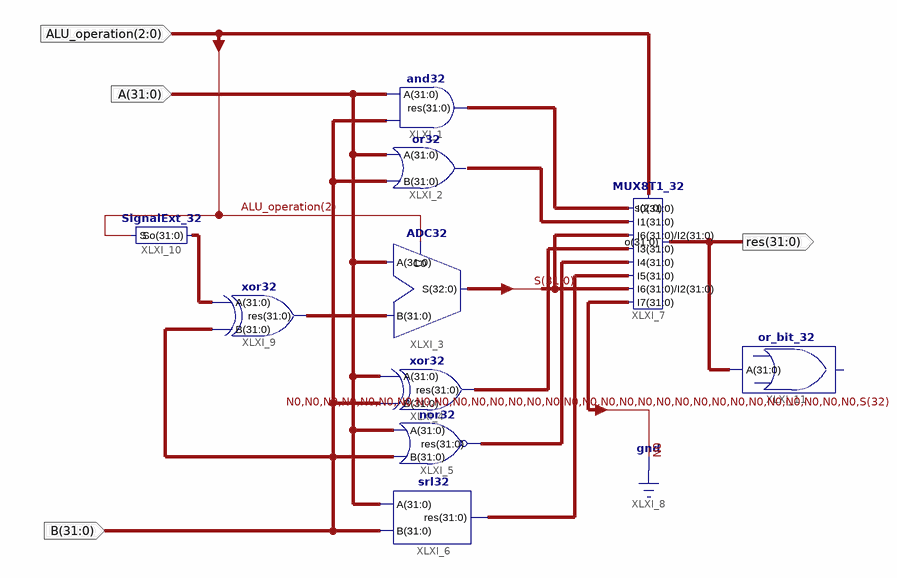
[diagram p0: schematic sheet 1]
// Xilinx ISE schematic alu.sch (kintex7) as structural Verilog: 10 symbols, 4 ports
module alu (
  input  [31:0] A,
  input  [31:0] B,
  input  [2:0] ALU_operation,
  output [31:0] res
);

  wire [31:0] XLXN_4, XLXN_5, XLXN_7, XLXN_8, XLXN_9, XLXN_12, XLXN_16;
  wire [32:0] S;

  and32 XLXI_1 (.res(XLXN_4), .A(A), .B(B));
  or32 XLXI_2 (.res(XLXN_5), .A(A), .B(B));
  ADC32 XLXI_3 (.B(XLXN_12), .A(A), .C0(ALU_operation[2]), .S(S));
  xor32 XLXI_4 (.A(A), .B(B), .res(XLXN_7));
  nor32 XLXI_5 (.res(XLXN_8), .A(A), .B(B));
  srl32 XLXI_6 (.A(A), .B(B), .res(XLXN_9));
  MUX8T1_32 XLXI_7 (
    .s(ALU_operation), .I7({{31{1'b0}}, S[32]}), .I6(S[31:0]), .I5(XLXN_9), .I4(XLXN_8), .I3(XLXN_7),
    .I2(S[31:0]), .I1(XLXN_5), .I0(XLXN_4), .o(res));
  xor32 XLXI_9 (.A(XLXN_16), .B(B), .res(XLXN_12));
  SignalExt_32 XLXI_10 (.So(XLXN_16), .S(ALU_operation[2]));
  or_bit_32 XLXI_11 (.A(res));  // open: o
endmodule
